# Altium schematic sheet CKT_C20003-AB_V101.SchDoc
size 330 x 219 mm
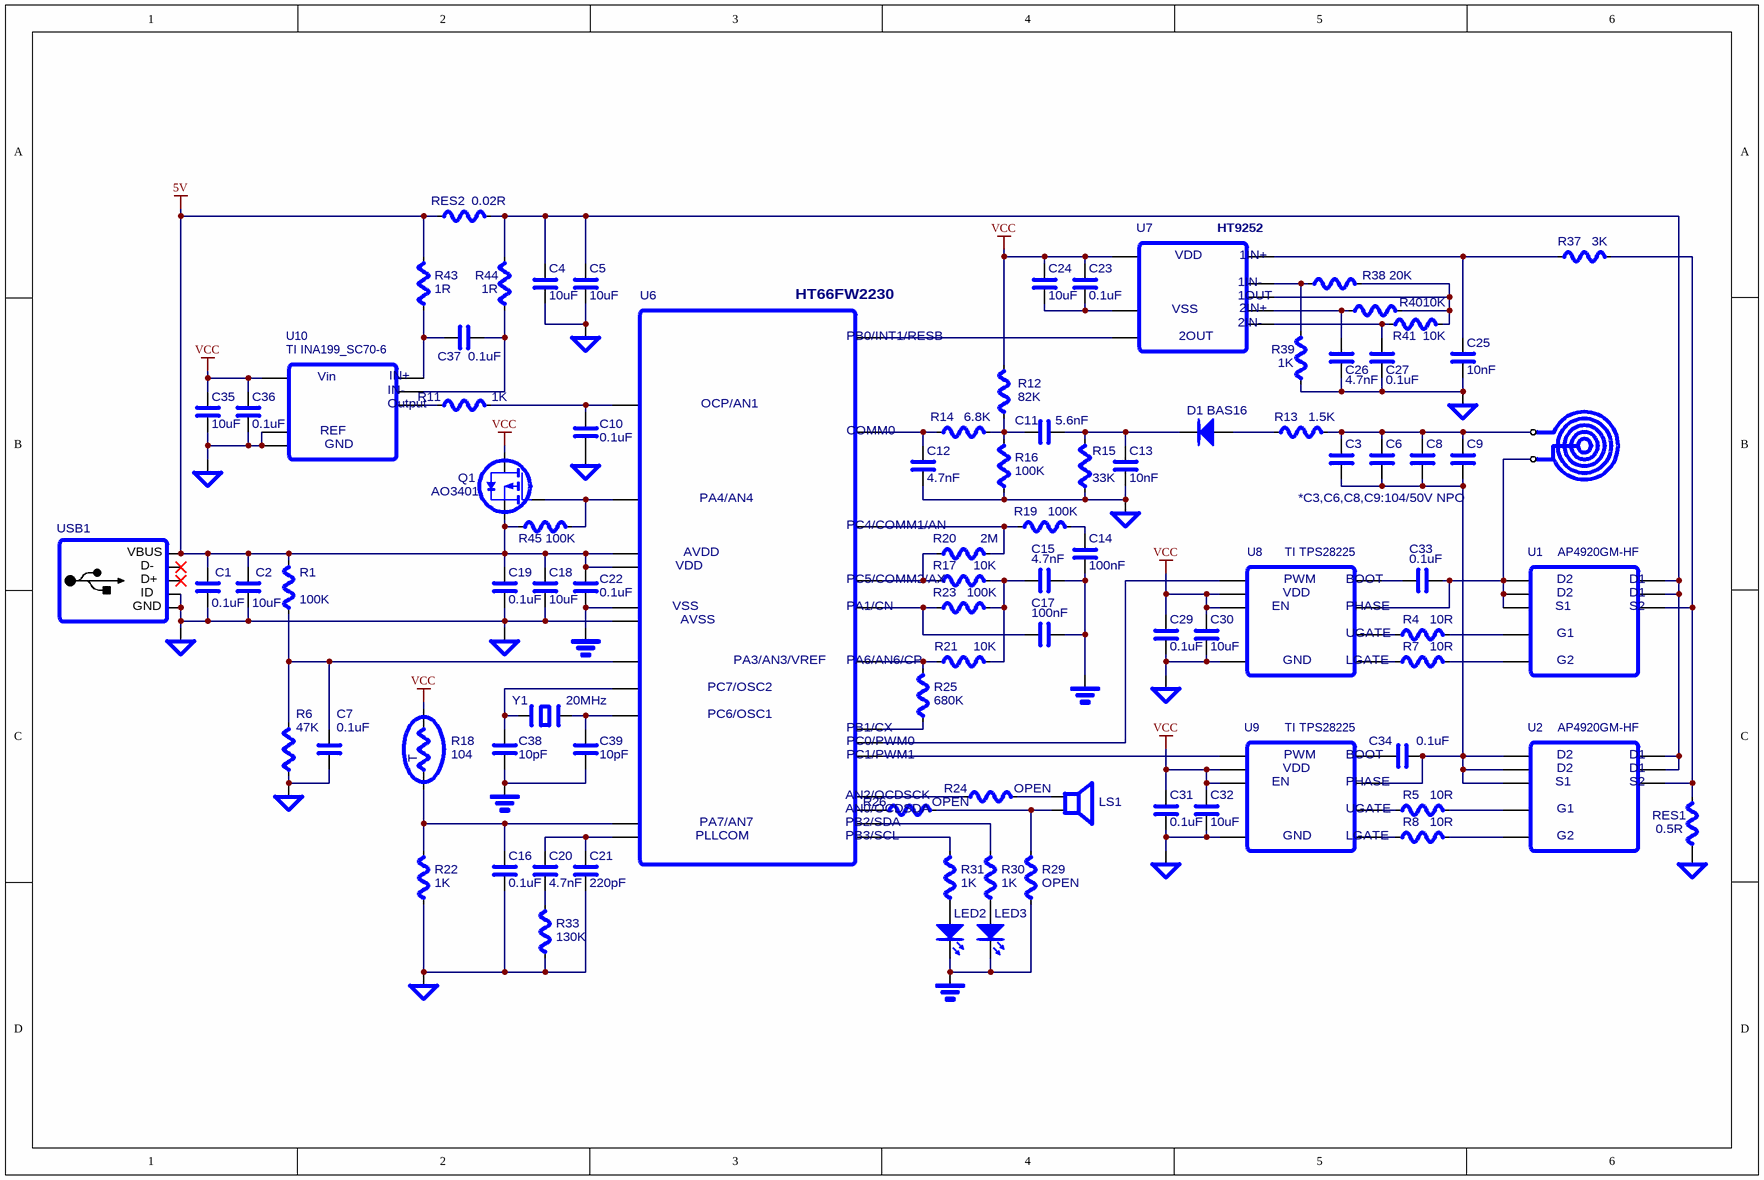
[diagram p0: CKT_C20003-AB_V101.SchDoc]

## Parts
(Parts that share a designator on the sheet are numbered #1, #2 ... from top to bottom, then left to right.)
*#1  GND(1)  (value not drawn)
*#2  GND(1)  (value not drawn)
*#3  GND(1)  (value not drawn)
*#4  GND(1)  (value not drawn)
*#5  GND(1)  (value not drawn)
*#6  GND(1)  (value not drawn)
*#7  GND  (value not drawn)
*#8  GND  (value not drawn)
*#9  GND(1)  (value not drawn)
*#10  GND  (value not drawn)
*#11  GND(1)  (value not drawn)
*#12  GND(1)  (value not drawn)
*#13  GND(1)  (value not drawn)
*#14  GND  (value not drawn)
*?  Component_1  (value not drawn)
?#1  GND(1)  (value not drawn)
?#2  GND(1)  (value not drawn)
C1  0.1uF
C2  10uF
C3  0.1uF  (value not drawn)
C4  10uF
C5  10uF
C6  0.1uF  (value not drawn)
C7  0.1uF
C8  0.1uF  (value not drawn)
C9  0.1uF  (value not drawn)
C10  0.1uF
C11  5.6nF
C12  4.7nF
C13  10nF
C14  100nF
C15  4.7nF
C16  0.1uF
C17  100nF
C18  10uF
C19  0.1uF
C20  4.7nF
C21  220pF
C22  0.1uF
C23  0.1uF
C24  10uF
C25  10nF
C26  4.7nF
C27  0.1uF
C29  0.1uF
C30  10uF
C31  0.1uF
C32  10uF
C33  0.1uF
C34  0.1uF
C35  10uF
C36  0.1uF
C37  0.1uF
C38  10pF
C39  10pF
D1  BAS16  [SMC]
LED2  LED(G)  [LED3M]  (value not drawn)
LED3  LED(B)  [LED3M]  (value not drawn)
LS1  Speaker  [PIN2]  (value not drawn)
Q1  AO3401  [TO-220AB]
R1  100K
R4  10R
R5  10R
R6  47K
R7  10R
R8  10R
R11  1K
R12  82K
R13  1.5K
R14  6.8K
R15  33K
R16  100K
R17  10K
R18  104
R19  100K
R20  2M
R21  10K
R22  1K
R23  100K
R24  OPEN
R25  680K
R26  OPEN
R29  OPEN
R30  1K
R31  1K
R33  130K
R37  3K
R38  20K
R39  1K
R40  10K
R41  10K
R43  1R
R44  1R
R45  100K
RES1  0.5R
RES2  0.02R
U1  AP4920GM-HF  [SOP8-150]
U2  AP4920GM-HF  [SOP8-150]
U6  HT66FW2230  [SSOP28_150]  (value not drawn)
U7  HT9252_1  (value not drawn)
U8  TI TPS28225  [SOP8-150]
U9  TI TPS28225  [SOP8-150]
U10  TI INA199_SC70-6  [SC70]
USB1  USB(2)  (value not drawn)
Y1  20MHz  [XTAL-49US]

## Nets
5V: C1.2 C2.2 C18.2 C19.2 C22.2 Q1.3(S) R1.1 R43.2 R45.1 RES2.1 U6.8(VDD) U6.19(AVDD) USB1.1(VDD)
VCC: C23.2 C24.2 C29.2 C30.2 C31.2 C32.2 C35.2 C36.2 Q1.2(D) R12.1 R18.2 U7.8(VDD) U8.6(VDD) U8.7(EN) U9.6(VDD) U9.7(EN) U10.3(Vin)
Net*#1_?1: *#1.?1 C4.1 C5.1
Net*#2_?1: *#2.?1 C25.2 C26.1 C27.2 R39.2
Net*#3_?1: *#3.?1 C10.1
Net*#4_?1: *#4.?1 C35.1 C36.1 U10.1(REF) U10.2(GND)
Net*#5_?1: *#5.?1 *#6.?1 C1.1 C2.1 C18.1 C19.1 U6.20(AVSS) USB1.4(GND)
Net*#7_?1: *#7.?1 C22.1 U6.7(VSS)
Net*#8_?1: *#8.?1 C14.2 C15.2 C17.1
Net*#9_?1: *#9.?1 C7.2 R6.1
Net*#10_?1: *#10.?1 C38.1 C39.1
Net*#11_?1: *#11.?1 C31.1 C32.1 U9.4(GND)
Net*#12_?1: *#12.?1 RES1.2
Net*#13_?1: *#13.?1 C16.1 C21.1 R22.2 R33.2
Net*#14_?1: *#14.?1 LED2.2(K) LED3.2(K) R29.2
Net*?_1: *?.1 C3.1 C6.1 C8.1 C9.1 R13.2
Net*?_2: *?.2 C33.1 U1.1(S1) U1.5(D2) U1.6(D2) U8.8(PHASE)
Net?#1_?1: ?#1.?1 C12.1 C13.1 R15.1 R16.1
Net?#2_?1: ?#2.?1 C29.1 C30.1 U8.4(GND)
NetC3_2: C3.2 C6.2 C8.2 C9.2 C34.1 U2.1(S1) U2.5(D2) U2.6(D2) U9.8(PHASE)
NetC4_2: C4.2 C5.2 R44.2 RES2.2 U1.7(D1) U1.8(D1) U2.7(D1) U2.8(D1)
NetC7_1: C7.1 R1.2 R6.2 U6.23(PA3/AN3/VREF)
NetC10_2: C10.2 R11.2 U6.22(OCP/AN1)
NetC11_1: C11.1 C13.2 D1.2(K) R15.2
NetC11_2: C11.2 R12.2 R14.2 R16.2
NetC12_2: C12.2 R14.1 U6.27(COMM0)
NetC14_1: C14.1 R19.2
NetC15_1: C15.1 R17.2 R21.2 R23.2
NetC16_2: C16.2 R18.1 R22.1 U6.26(PA7/AN7)
NetC17_2: C17.2 R23.1 U6.3(PA1/CN)
NetC20_1: C20.1 R33.1
NetC20_2: C20.2 C21.2 U6.21(PLLCOM)
NetC23_1: C23.1 C24.1 U7.4(VSS)
NetC25_1: C25.1 R37.1 U7.3(1IN+)
NetC26_2: C26.2 R40.1 U7.5(2IN+)
NetC27_1: C27.1 R41.1 U7.6(2IN-)
NetC33_2: C33.2 U8.2(BOOT)
NetC34_2: C34.2 U9.2(BOOT)
NetC37_1: C37.1 R44.1 U10.5(IN-)
NetC37_2: C37.2 R43.1 U10.4(IN+)
NetC38_2: C38.2 U6.17(PC7/OSC2) Y1.2(OSC2)
NetC39_2: C39.2 U6.18(PC6/OSC1) Y1.1(OSC1)
NetD1_1: D1.1(A) R13.1
NetLED2_1: LED2.1(A) R31.2
NetLED3_1: LED3.1(A) R30.2
NetLS1_1: LS1.1 R24.2
NetLS1_2: LS1.2 R26.2 R29.1
NetQ1_1: Q1.1(G) R45.2 U6.24(PA4/AN4)
NetR4_1: R4.1 U8.1(UGATE)
NetR4_2: R4.2 U1.2(G1)
NetR5_1: R5.1 U9.1(UGATE)
NetR5_2: R5.2 U2.2(G1)
NetR7_1: R7.1 U8.5(LGATE)
NetR7_2: R7.2 U1.4(G2)
NetR8_1: R8.1 U9.5(LGATE)
NetR8_2: R8.2 U2.4(G2)
NetR11_1: R11.1 U10.6(Output)
NetR17_1: R17.1 R20.1 U6.1(PC5/COMM2/AX)
NetR19_1: R19.1 R20.2 U6.28(PC4/COMM1/AN)
NetR21_1: R21.1 R25.1 U6.2(PA6/AN6/CP)
NetR24_1: R24.1 U6.6(AN2/OCDSCK)
NetR25_2: R25.2 U6.4(PB1/CX)
NetR26_1: R26.1 U6.5(AN0/OCDSDA)
NetR30_1: R30.1 U6.13(PB2/SDA)
NetR31_1: R31.1 U6.14(PB3/SCL)
NetR37_2: R37.2 RES1.1 U1.3(S2) U2.3(S2)
NetR38_1: R38.1 R39.1 U7.2(1IN-)
NetR38_2: R38.2 R40.2 R41.2 U7.1(1OUT)
NetU6_11: U6.11(PC1/PWM1) U9.3(PWM)
NetU6_12: U6.12(PC0/PWM0) U8.3(PWM)
NetU6_16: U6.16(PB0/INT1/RESB) U7.7(2OUT)

Not connected (* = marked no-connect by the designer): USB1 2(D-)* 3(D+)*

## Notes on the sheet
- *C3,C6,C8,C9:104/50V NPO
- (in symbol HT9252_1) HT9252
- (in symbol SENSOR(1)) T
- (in symbol USB(2)) VBUS; ID

## Library data of the parts
*? = Component_1_1
C1-C27 C29-C39 = CAP(1): Capacitor; Published: 8-Jun-2000; LatestRevisionDate: 17-Jul-2002; LatestRevisionNote: Re-released for DXP Platform.; PackageReference: RAD-0.3; Publisher: Altium Limited
D1 = DIODE: Default Diode; Published: 8-Jun-2000; LatestRevisionDate: 17-Jul-2002; LatestRevisionNote: Re-released for DXP Platform.; PackageVersion: Sep-1996; PackageReference: SMC; Publisher: Altium Limited; PackageDescription: DO-214-AB/SMC; 2 C-Bend Leads; Body 7.9 x 5.9 mm, inc. leads (LxW); Code_JEDEC: DO-214-AB
LED2 LED3 = LED: Typical INFRARED GaAs LED; Published: 8-Jun-2000; LatestRevisionDate: 08-Jul-2005; LatestRevisionNote: Mech Layer 1 removed.; PackageReference: LED-0; Publisher: Altium Limited; PackageDescription: LED; 2 Leads
LS1 = Speaker: Loudspeaker; Published: 24-Mar-1999; LatestRevisionDate: 17-Jul-2002; LatestRevisionNote: Re-released for DXP Platform.; PackageReference: PIN2; Publisher: Altium Limited
Q1 = PMOS(1)_1: P-Channel Power MOSFET; Note: Pin 2 is electrically connected to pin 4.; Published: 8-Jun-2000; LatestRevisionDate: 17-Jul-2002; LatestRevisionNote: Re-released for DXP Platform.; DatasheetVersion: PD-9.814; PackageVersion: Feb-1997; PackageReference: TO-220AB; Publisher: Altium Limited; PackageDescription: TO, Thru-Hole, Vertical, Heatsink Mounted; 3 In-Line Leads; Pitch 2.54 mm; ComponentLink1Description: Manufacturer Link; ComponentLink1URL: http://www.irf.com/
R1 R4-R8 R11-R17 R19-R26 R29-R31 R33 R37-R41 R43-R45 RES1 RES2 = RESISTOR
R18 = SENSOR(1): SENSOR
U1 U2 = AP4920GM-HF_1: EDIFviewName: AP4920GM_HF_NORMAL; EDIForiginalOrigin: (pt 0 0); PositionInPackage: 0; Number devices in Package: 1; Pin Numbers Visible: True; Implementation Type: <none>; Source Package: AP4920GM-HF; Pin Names Rotate: True; Pin Names Visible: True
U6 = NewHT45F3U_1
U8 U9 = TI TPS28225_1: EDIFviewName: TI_TPS28225_NORMAL; EDIForiginalOrigin: (pt 0 0); PositionInPackage: 0; Number devices in Package: 1; Pin Names Visible: True; Implementation Type: <none>; Source Package: TI TPS28225; Pin Numbers Visible: True; Pin Names Rotate: True
U10 = INA199_0_1: EDIFviewName: INA199_0_NORMAL; EDIForiginalOrigin: (pt 0 0); PositionInPackage: 0; Number devices in Package: 1; Pin Names Visible: True; Implementation Type: <none>; Source Package: INA199_0; Pin Numbers Visible: True; Pin Names Rotate: True
Y1 = XTAL: Crystal Oscillator; Published: 8-Jun-2000; LatestRevisionDate: 17-Jul-2002; LatestRevisionNote: Re-released for DXP Platform.; PackageReference: R38; Publisher: Altium Limited; PackageDescription: Crystal, Thru-Hole; 2 Leads; Body 3.1 x 8.2 mm (Dia.xH)